# EasyEDA Pro project ProDoc_Board1_2025-08-02.epro

# Schematic Schematic1
Board Name: Board1; Create Date: 2025-07-23; Page Name: P1; Project Name: Silicon dev board; Schematic Name: Schematic1; Update Date: 2025-08-02; Company: EasyEDA.com; Page Size: A4; Version: V1.0
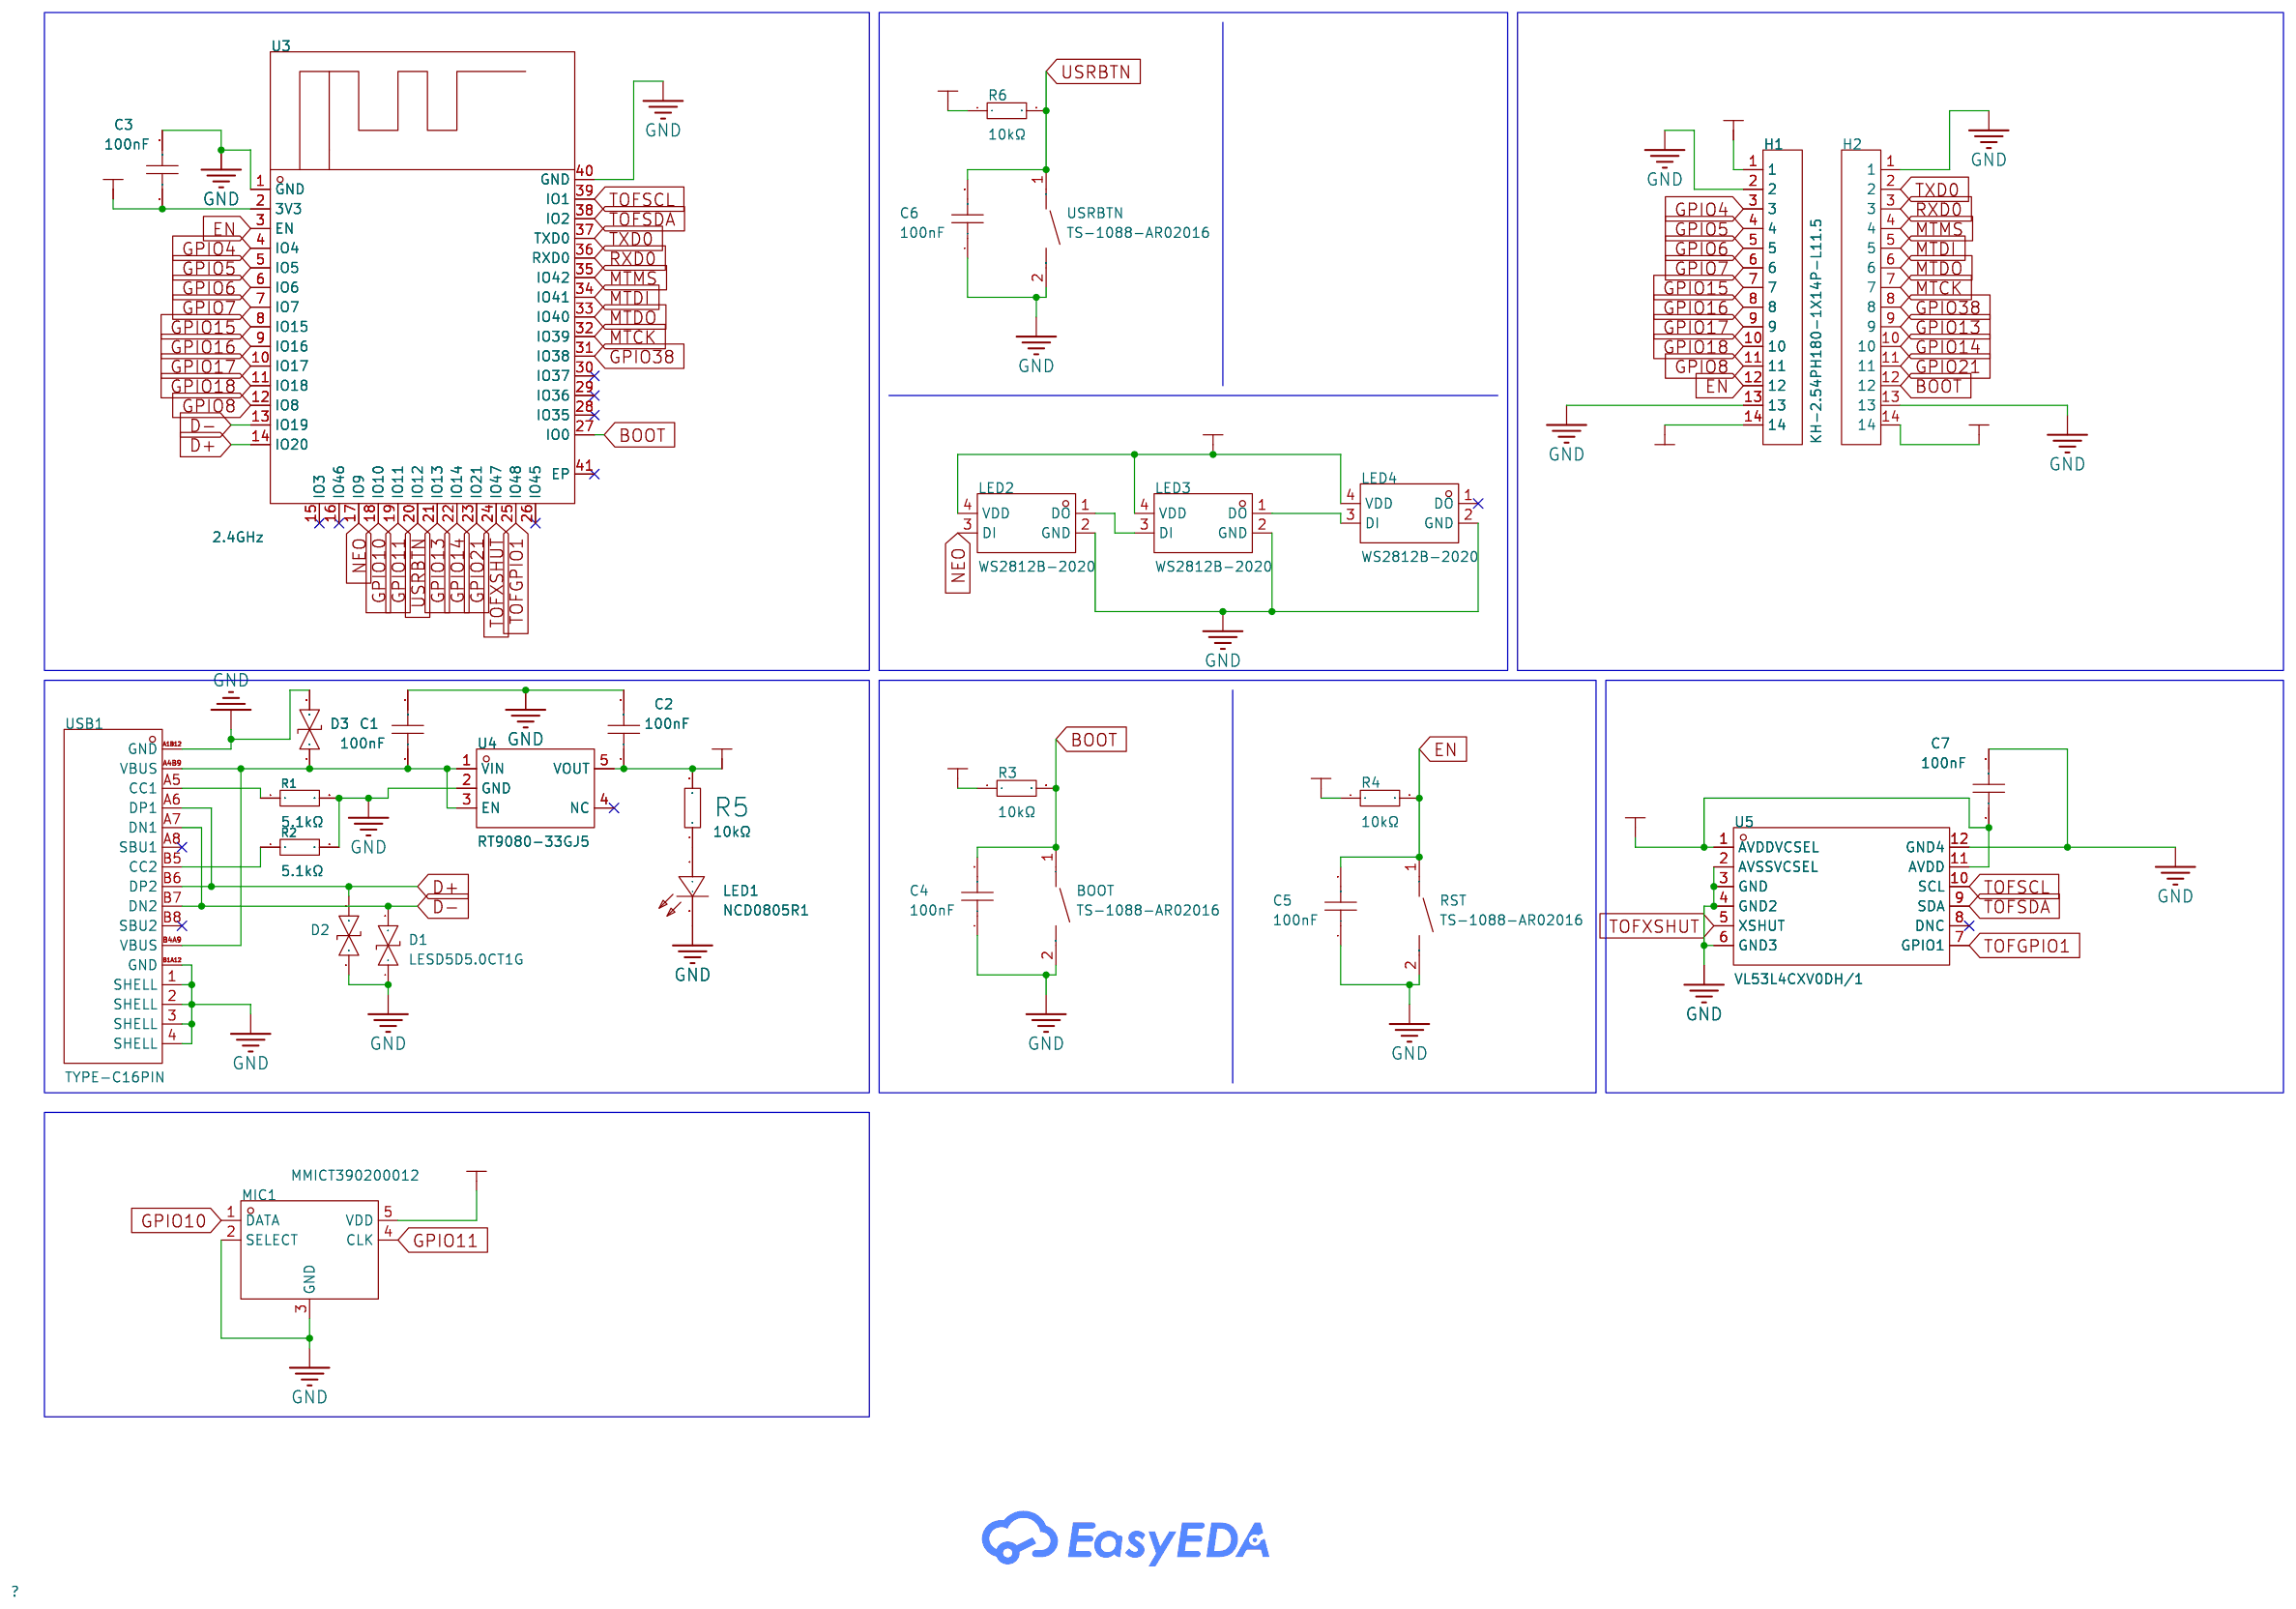
[diagram p0: schematic sheet]

## Parts
BOOT  TS-1088-AR02016  [SW-SMD_L3.9-W3.0-P4.45]
C1  100nF  [C0805]
C2  100nF  [C0805]
C3  100nF  [C0805]
C4  100nF  [C0805]
C5  100nF  [C0805]
C6  100nF  [C0805]
C7  100nF  [C0805]
D1  LESD5D5.0CT1G  [SOD-523_L1.2-W0.8-LS1.6-BI]
D2  LESD5D5.0CT1G  [SOD-523_L1.2-W0.8-LS1.6-BI]
D3  LESD5D5.0CT1G  [SOD-523_L1.2-W0.8-LS1.6-BI]
H1  KH-2.54PH180-1X14P-L11.5  [HDR-TH_14P-P2.54-V-M]
H2  KH-2.54PH180-1X14P-L11.5  [HDR-TH_14P-P2.54-V-M]
LED1  NCD0805R1  [LED0805-R-RD]
LED2  WS2812B-2020  [LED-SMD_4P-L2.0-W2.0-TL_WS2812B-2020]
LED3  WS2812B-2020  [LED-SMD_4P-L2.0-W2.0-TL_WS2812B-2020]
LED4  WS2812B-2020  [LED-SMD_4P-L2.0-W2.0-TL_WS2812B-2020]
MIC1  MMICT390200012  [MIC-SMD_5P-L3.5-W2.7-TL_MMICT390200012]
R1  5.1kΩ  [R0805]
R2  5.1kΩ  [R0805]
R3  10kΩ  [R0805]
R4  10kΩ  [R0805]
R5  10kΩ  [R0603]
R6  10kΩ  [R0805]
RST  TS-1088-AR02016  [SW-SMD_L3.9-W3.0-P4.45]
U3  2.4GHz  [WIFIM-SMD_ESP32-S3-WROOM-1-N8]
U4  RT9080-33GJ5  [TSOT-23-5_L2.9-W1.6-P0.95-LS2.8-BL]
U5  VL53L4CXV0DH/1  [OPTO-SMD_VL53L1CXV0FY-1]
USB1  TYPE-C16PIN  [USB-C-SMD_TYPE-C16PIN]
USRBTN  TS-1088-AR02016  [SW-SMD_L3.9-W3.0-P4.45]

## Library data of the parts
BOOT RST USRBTN = TS-1088-AR02016: Circuit:SPST Actuator Style:Round Button Operating Force:160gf Mounting Style:Brick nogging Switch Length:4mm Switch Width:3mm Switch Height:2mm Strike Gundam:不带 Contact Current:50mA Voltage Rating (DC):12V Insulation Resistance:100MΩ Actuator/Cap Color:B; LCSC Part Name: 4*3*2mm 立贴 轻触开关; Supplier Part: C720477; Manufacturer: XUNPU(讯普); Supplier Footprint: SMD; JLCPCB Part Class: Basic Part; Datasheet: https://atta.szlcsc.com/upload/public/pdf/source/20200810/C720475_60D09DD6C54279ADDB2DC25100F1CC11.pdf; Supplier: LCSC; Circuit: SPST; Actuator Style: Round Button; Operating Force: 160gf; Mounting Style: Brick nogging; Switch Length: 4mm; Switch Width: 3mm; Switch Height: 2mm; Strike Gundam: 不带; Contact Current: 50mA; Voltage Rating (DC): 12V; Insulation Resistance: 100MΩ; Actuator/Cap Color: Black; Pin Style: SMDSplicing; Mechanical Life: 10万次; Operating Temperature: -30℃~+80℃
C1-C7 = C0805B104K500NT: Capacitance:100nF Tolerance:±10% Tolerance:±10% Voltage Rating:50V Temperature Coefficient:X7R; LCSC Part Name: 100nF ±10% 50V; Supplier Part: C476766; Manufacturer: TORCH(火炬); Supplier Footprint: 0805; JLCPCB Part Class: Extended Part; Datasheet: https://atta.szlcsc.com/upload/public/pdf/source/20191230/C476766_171E30D5B7F7164A8210B8E948DFBAE0.pdf; Supplier: LCSC; Tolerance: ±10%; Voltage Rating: 50V; Temperature Coefficient: X7R
D1-D3 = LESD5D5.0CT1G: Polarity:Bidirectional Reverse Stand-Off Voltage (Vrwm):5V Clamping Voltage:18.6V Peak Pulse Current (Ipp):9.4A Voltage - Breakdown:5.6V Type:ESD; LCSC Part Name: 双向ESD; Supplier Part: C383211; Manufacturer: LRC(乐山无线电); Supplier Footprint: SOD-523; JLCPCB Part Class: Extended Part; Datasheet: https://atta.szlcsc.com/upload/public/pdf/source/20190807/C383211_633DF4B4E2C161403226E5235FE33A1C.pdf; Supplier: LCSC; Polarity: Bidirectional; Reverse Stand-Off Voltage (Vrwm): 5V; Clamping Voltage: 18.6V; Peak Pulse Current (Ipp): 9.4A; Voltage - Breakdown: 5.6V; Type: ESD
H1 H2 = KH-2.54PH180-1X14P-L11.5: Pin Structure:1x14P Pitch:2.54mm Row Spacing:- Circluar Pins/Square Pins:Policy Mounting Type:Straight Number of Rows:Single Row Number of Pins:14P Current Rating:3A Voltage Rating (Max):- Length of Mating Pin:6mm Insulation Height:2.5mm Length of End Con; LCSC Part Name: 1x14P 间距:2.54mm 方针 直插; Supplier Part: C2905490; Manufacturer: kinghelm(金航标); Supplier Footprint: 插件,P=2.54mm; JLCPCB Part Class: Extended Part; Datasheet: https://atta.szlcsc.com/upload/public/pdf/source/20211019/70B2F9BE166FB5933520F36B6C0BD4AD.pdf; Supplier: LCSC; Pin Structure: 1x14P; Pitch: 2.54mm; Circluar Pins/Square Pins: Policy; Mounting Type: Straight; Number of Rows: Single Row; Number of Pins: 14P; Current Rating: 3A; Length of Mating Pin: 6mm; Insulation Height: 2.5mm; Length of End Connection Pin: 3mm; Operating Temperature: -40℃~+105℃; Color: Black
LED1 = NCD0805R1_C84256: Lamp Holder Type:- Emitted Color:Red Forward Voltage (VF):1.6V~2.6V Forward Voltage (VF):1.6V~2.6V Power Dissipation:65mW Forward Current:20mA Dominant Wavelength:615nm~630nm Dominant Wavelength:615nm~630nm Peak Wavelength:- Diode Configuration:独立二极管 Lens; Supplier Part: C84256; Manufacturer: 国星光电; Supplier Footprint: 0805; JLCPCB Part Class: Basic Part; Datasheet: https://atta.szlcsc.com/upload/public/pdf/source/20200820/C84256_F0A75A43B3EAD75808600A0514C76B99.pdf; Supplier: LCSC; Emitted Color: Red; Forward Voltage (VF): 1.6V~2.6V; Power Dissipation: 65mW; Forward Current: 20mA; Dominant Wavelength: 615nm~630nm; Diode Configuration: 独立二极管; Lens Color: 无色透明透镜; Luminous Intensity: 67mcd~195mcd; Viewing Angle: 130°; Operating Temperature: -30℃~+85℃
LED2-LED4 = WS2812B-2020: Wavelength:515.6nm；622.5nm；470.4nm Luminous Intensity:- Fixed-Frequency Pwm Mode:- Data Transmission Rate:- Supply Voltage:- Supply Voltage:- Quiescent Dissipation:- Lens Color:-; LCSC Part Name: RGB三色; Supplier Part: C965555; Manufacturer: worldsemi; Supplier Footprint: SMD,2x2mm; JLCPCB Part Class: Extended Part; Datasheet: https://atta.szlcsc.com/upload/public/pdf/source/20241202/DEE3FC25B8AD87F3BB1718ACD77EDECD.pdf; Supplier: LCSC; Wavelength: 515.6nm；622.5nm；470.4nm
MIC1 = MMICT390200012: Direction:Omni-directional Voltage - Supply:1.65V~3.63V Voltage - Supply:1.65V~3.63V Current Consumption:650uA Current Consumption:650uA S/N Ratio:64dB Sensitivity:-32dB Sensitivity:-32dB Impedance:-; Supplier Part: C3171752; Manufacturer: TDK InvenSense(应美盛); JLCPCB Part Class: Extended Part; Datasheet: https://atta.szlcsc.com/upload/public/pdf/source/231023/C17526790-e655196fc8b61186ca7c7f8236c0f1c0.pdf; Supplier: LCSC; Direction: Omni-directional; Voltage - Supply: 1.65V~3.63V; Current Consumption: 650uA; S/N Ratio: 64dB; Sensitivity: -32dB
R1 R2 = RMC08055.1K1%N: Resistance:5.1kΩ Tolerance:±1% Tolerance:±1% Power(Watts):0.125W; LCSC Part Name: 5.1kΩ ±1% 125mW; Supplier Part: C269748; Manufacturer: Tyohm(幸亚电阻); Supplier Footprint: 0805; JLCPCB Part Class: Extended Part; Datasheet: https://atta.szlcsc.com/upload/public/pdf/source/20190115/C325956_D27151D492FFB3C9AB4A6F14FE01F30A.pdf; Supplier: LCSC; Tolerance: ±1%; Power(Watts): 0.125W
R3 R4 R6 = PTFR0805B10K0N9: Type:Thin Film Resistor Resistance:10kΩ Tolerance:±0.1% Tolerance:±0.1% Power(Watts):130mW Voltage-Supply(Max):150V Temperature Coefficient:±10ppm/℃ Temperature Coefficient:±10ppm/℃ Operating Temperature:-55℃~+125℃ Operating Temperature:-55℃~+125℃; LCSC Part Name: 薄膜电阻 10kΩ ±0.1% 130mW 车规级; Supplier Part: C328436; Manufacturer: RESI(开步睿思); Supplier Footprint: 0805; JLCPCB Part Class: Extended Part; Datasheet: https://atta.szlcsc.com/upload/public/pdf/source/20240506/11BDC7478D84177AC2A5326A65B6EB29.pdf; Supplier: LCSC; Type: Thin Film Resistor; Tolerance: ±0.1%; Power(Watts): 130mW; Voltage-Supply(Max): 150V; Temperature Coefficient: ±10ppm/℃; Operating Temperature: -55℃~+125℃
R5 = 0603WAF1002T5E: Type:Thick Film Resistor Resistance:10kΩ Tolerance:±1% Tolerance:±1% Power(Watts):100mW Voltage-Supply(Max):75V Temperature Coefficient:±100ppm/℃ Temperature Coefficient:±100ppm/℃ Operating Temperature:-55℃~+155℃ Operating Temperature:-55℃~+155℃; LCSC Part Name: 厚膜电阻 10kΩ ±1% 100mW; Supplier Part: C25804; Manufacturer: UNI-ROYAL(厚声); Supplier Footprint: 0603; JLCPCB Part Class: Basic Part; Datasheet: https://atta.szlcsc.com/upload/public/pdf/source/20200306/C422600_1E6D84923E4A46A82E41ADD87F860B5C.pdf; Supplier: LCSC; Type: Thick Film Resistor; Tolerance: ±1%; Power(Watts): 100mW; Voltage-Supply(Max): 75V; Temperature Coefficient: ±100ppm/℃; Operating Temperature: -55℃~+155℃
U3 = ESP32-S3-WROOM-1-N8: Core Processor:ESP32-S3 Chip Support Interface:I2C；GPIO；SPI；PWM；ADC；UART；USB；I2S Frequency:2.4GHz; LCSC Part Name: 通用型Wi-Fi+低功耗蓝牙MCU模组; Supplier Part: C2913198; Manufacturer: ESPRESSIF(乐鑫); Supplier Footprint: SMD,18x25.5mm; JLCPCB Part Class: Extended Part; Datasheet: https://atta.szlcsc.com/upload/public/pdf/source/20221026/9A44C6421221D672346AAE72DF9F8146.pdf; Supplier: LCSC; Core Processor: ESP32-S3 Chip; Support Interface: I2C；GPIO；SPI；PWM；ADC；UART；USB；I2S
U4 = RT9080-33GJ5: Output Type:Fixed Maximum Input Voltage:5.5V Output Voltage:3.3V Output Voltage:3.3V Output Current:600mA Power Supply Rejection Ratio (PSRR):75dB@(1kHz) Dropout Voltage:530mV@(600mA) standby current:4uA Feature:ESD Protection；Thermal Protection(TSD)；Over; Supplier Part: C841192; Manufacturer: RICHTEK(立锜); Supplier Footprint: TSOT-23-5; JLCPCB Part Class: Extended Part; Datasheet: https://atta.szlcsc.com/upload/public/pdf/source/20200918/C841192_D291BBB33AFC8816B317CCB22A728955.pdf; Supplier: LCSC; Output Type: Fixed; Maximum Input Voltage: 5.5V; Output Voltage: 3.3V; Output Current: 600mA; Power Supply Rejection Ratio (PSRR): 75dB@(1kHz); Dropout Voltage: 530mV@(600mA); standby current: 4uA; Feature: ESD Protection；Thermal Protection(TSD)；Overcurrent Protection(OCP)；With ability; Operating Temperature: -40℃~+85℃@(Ta); Output Polarity: Positive electrode; Number of Outputs: 1
U5 = VL53L4CXV0DH/1: Voltage - Supply:2.6V~3.5V Voltage - Supply:2.6V~3.5V Linear Range:0m~6m Linear Range:0m~6m Current - Supply:21mA; LCSC Part Name: I2C接口的具有扩展范围测量的飞行时间传感器; Supplier Part: C3178292; Manufacturer: ST(意法半导体); Supplier Footprint: SMD-12P,2.4x4.4mm; JLCPCB Part Class: Extended Part; Datasheet: https://atta.szlcsc.com/upload/public/pdf/source/20221107/6F567E0F7F9EC6D2C71C63496C772559.pdf; Supplier: LCSC; Voltage - Supply: 2.6V~3.5V; Linear Range: 0m~6m; Current - Supply: 21mA
USB1 = TYPE-C16PIN: Connector Type:Type-C Protocol Standard:USB 3.1 Gender:Female Mounting Type:Surface Mount, Right Angle Number of Contacts:16P Number of Ports:1 Current Rating-Power:3A Voltage Rating:30V Connect-Disconnect Life:10,000 Cycles Detection color:Black Operatin; LCSC Part Name: Type-C 母 卧贴; Supplier Part: C393939; Manufacturer: SHOU HAN(首韩); Supplier Footprint: SMD; JLCPCB Part Class: Extended Part; Datasheet: https://atta.szlcsc.com/upload/public/pdf/source/20250618/9FBF2A26CFCE0E69298FA0B726710E9E.pdf; Supplier: LCSC; Connector Type: Type-C; Protocol Standard: USB 3.1; Gender: Female; Mounting Type: Surface Mount, Right Angle; Number of Contacts: 16P; Number of Ports: 1; Current Rating-Power: 3A; Voltage Rating: 30V; Connect-Disconnect Life: 10,000 Cycles; Detection color: Black; Operating Temperature: -40℃~+85℃

## Nets
+3.3V: C2.1 C3.1 C7.1 H1.1 H1.14 H2.14 LED2.4(VDD) LED3.4(VDD) LED4.4(VDD) MIC1.5(VDD) R3.1 R4.1 R5.2 R6.1 U3.2(3V3) U4.5(VOUT) U5.1(AVDDVCSEL) U5.11(AVDD)
GND: BOOT.2 C1.2 C2.2 C3.2 C4.1 C5.1 C6.1 C7.2 D1.1 D2.1 D3.2 H1.2 H1.13 H2.1 H2.13 LED1.2(-) LED2.2(GND) LED3.2(GND) LED4.2(GND) MIC1.2(SELECT) MIC1.3(GND) R1.2 R2.2 RST.2 U3.1(GND) U3.40(GND) U4.2(GND) U5.2(AVSSVCSEL) U5.3(GND) U5.4(GND2) U5.6(GND3) U5.12(GND4) USB1.1(SHELL) USB1.2(SHELL) USB1.3(SHELL) USB1.4(SHELL) USB1.A1B12(GND) USB1.B1A12(GND) USRBTN.2
BOOT: BOOT.1 C4.2 H2.12 R3.2 U3.27(IO0)
D+: D2.2 U3.14(IO20) USB1.A6(DP1) USB1.B6(DP2)
D-: D1.2 U3.13(IO19) USB1.A7(DN1) USB1.B7(DN2)
EN: C5.2 H1.12 R4.2 RST.1 U3.3(EN)
GPIO4: H1.3 U3.4(IO4)
GPIO5: H1.4 U3.5(IO5)
GPIO6: H1.5 U3.6(IO6)
GPIO7: H1.6 U3.7(IO7)
GPIO8: H1.11 U3.12(IO8)
GPIO10: MIC1.1(DATA) U3.18(IO10)
GPIO11: MIC1.4(CLK) U3.19(IO11)
GPIO13: H2.9 U3.21(IO13)
GPIO14: H2.10 U3.22(IO14)
GPIO15: H1.7 U3.8(IO15)
GPIO16: H1.8 U3.9(IO16)
GPIO17: H1.9 U3.10(IO17)
GPIO18: H1.10 U3.11(IO18)
GPIO21: H2.11 U3.23(IO21)
GPIO38: H2.8 U3.31(IO38)
MTCK: H2.7 U3.32(IO39)
MTDI: H2.5 U3.34(IO41)
MTDO: H2.6 U3.33(IO40)
MTMS: H2.4 U3.35(IO42)
NEO: LED2.3(DI) U3.17(IO9)
RXD0: H2.3 U3.36(RXD0)
TOFGPIO1: U3.25(IO48) U5.7(GPIO1)
TOFSCL: U3.39(IO1) U5.10(SCL)
TOFSDA: U3.38(IO2) U5.9(SDA)
TOFXSHUT: U3.24(IO47) U5.5(XSHUT)
TXD0: H2.2 U3.37(TXD0)
USRBTN: C6.2 R6.2 U3.20(IO12) USRBTN.1
$1N1348: C1.1 D3.1 U4.1(VIN) U4.3(EN) USB1.A4B9(VBUS) USB1.B4A9(VBUS)
$1N1566: R1.1 USB1.A5(CC1)
$1N1581: R2.1 USB1.B5(CC2)
$1N3564: LED1.1(+) R5.1
$1N9702: LED2.1(DO) LED3.3(DI)
$1N9708: LED3.1(DO) LED4.3(DI)

Not connected (* = marked no-connect by the designer): LED4 1(DO)*; U3 15(IO3)* 16(IO46)* 26(IO45)* 28(IO35)* 29(IO36)* 30(IO37)* 41(EP)*; U4 4(NC)*; U5 8(DNC)*; USB1 A8(SBU1)* B8(SBU2)*

# Board PCB1
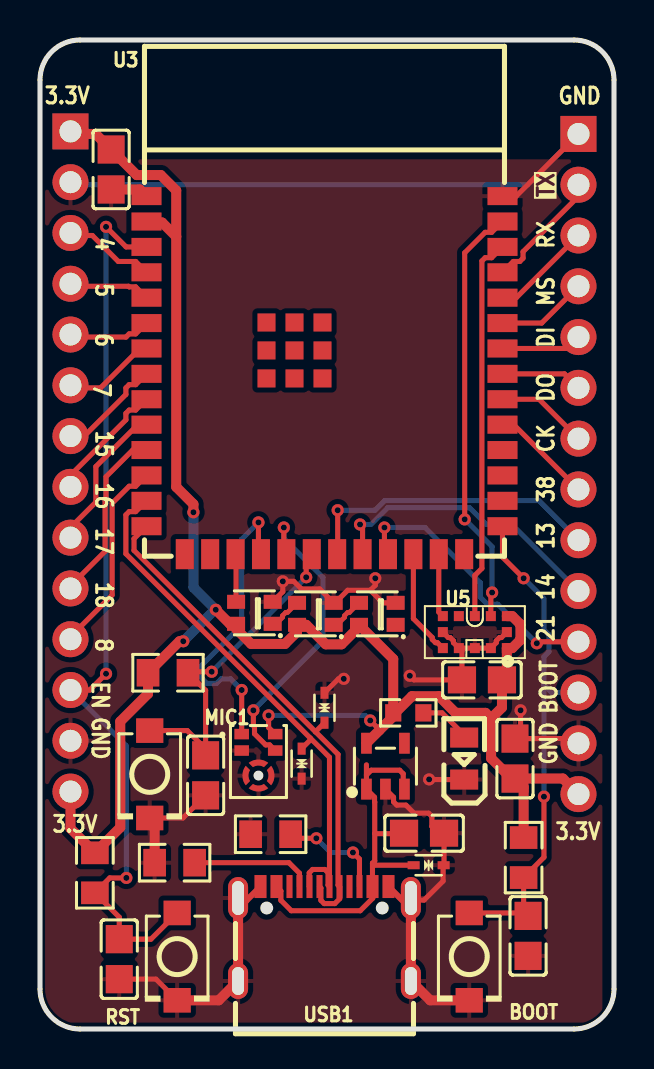
[diagram p1: board, top side]
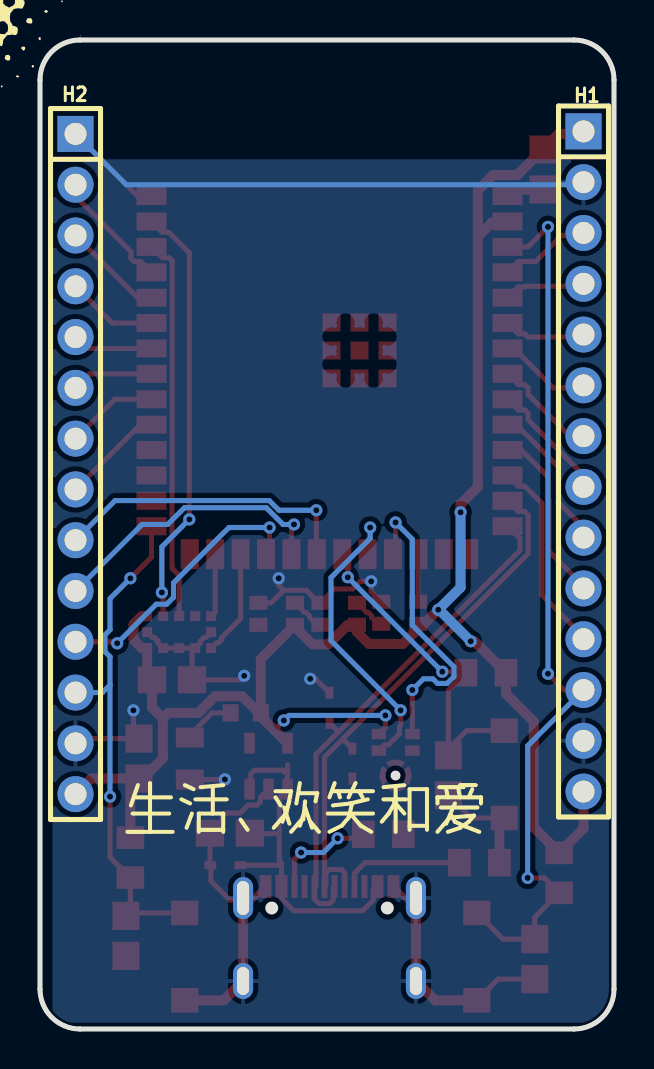
[diagram p2: board, bottom side, seen from below]

Outline 28.7 x 49.47 mm; copper layers: Top Layer, Bottom Layer. Coordinates in mm from the lower left corner of the outline.
Outline path: 0,47.47 0,2 arc(0.59,0.59) 2,0 26.7,0 arc(28.11,0.59) 28.7,2 28.7,47.47 arc(28.11,48.88) 26.7,49.47 2,49.47 arc(0.59,48.88) 0,47.47
Stack: Top Layer 0.035mm / Dielectric1 1.51mm FR4 er 4.5 / Bottom Layer 0.035mm

## Design rules (mm)
net D-: DP1
net D+: DP1
template: JLCPCB Capability(Two Layers Board)
spacing copperThickness1oz (default): track to track 0.102, other pairs 0.152 to 0.3
spacing copperThickness2oz: track to track 0.203, other pairs 0.152 to 0.3
track width copperThickness1oz (default): min 0.127, default 0.254, max 2.54
track width copperThickness2oz: min 0.203, default 0.254, max 2.54
differential pair differentialPair (default): width min 0.127, default 0.254, max 2.54; gap min 0.152, default 0.152
via viaSize (default): diameter min 0.5, default 0.61, max 10; hole min 0.3, default 0.305, max 6.3

## Placement (name value [footprint] x y rotation side)
BOOT  TS-1088-AR02016  [SW-SMD_L3.9-W3.0-P4.45]  21.46 3.62 270 top
C1  100nF  [C0805]  19.2 9.79 0 top
C2  100nF  [C0805]  23.75 13.53 90 top
C3  100nF  [C0805]  3.56 42.99 270 top
C4  100nF  [C0805]  24.4 4.66 90 top
C5  100nF  [C0805]  3.96 3.49 90 top
C6  100nF  [C0805]  8.28 12.69 90 top
C7  100nF  [C0805]  22.1 17.46 180 top
D1  LESD5D5.0CT1G  [SOD-523_L1.2-W0.8-LS1.6-BI]  13.08 13.27 90 top
D2  LESD5D5.0CT1G  [SOD-523_L1.2-W0.8-LS1.6-BI]  14.22 16.07 270 top
D3  LESD5D5.0CT1G  [SOD-523_L1.2-W0.8-LS1.6-BI]  19.43 8.19 0 top
H1  KH-2.54PH180-1X14P-L11.5  [HDR-TH_14P-P2.54-V-M]  1.52 28.39 270 bottom
H2  KH-2.54PH180-1X14P-L11.5  [HDR-TH_14P-P2.54-V-M]  26.92 28.26 270 bottom
LED1  NCD0805R1  [LED0805-R-RD]  21.21 13.53 90 top
LED2  WS2812B-2020  [LED-SMD_4P-L2.0-W2.0-TL_WS2812B-2020]  10.72 20.82 180 top
LED3  WS2812B-2020  [LED-SMD_4P-L2.0-W2.0-TL_WS2812B-2020]  13.77 20.77 180 top
LED4  WS2812B-2020  [LED-SMD_4P-L2.0-W2.0-TL_WS2812B-2020]  16.87 20.77 180 top
MIC1  MMICT390200012  [MIC-SMD_5P-L3.5-W2.7-TL_MMICT390200012]  10.92 13.4 0 top
R1  5.1kΩ  [R0805]  6.73 8.32 180 top
R2  5.1kΩ  [R0805]  11.53 9.74 180 top
R3  10kΩ  [R0805]  24.18 8.57 270 top
R4  10kΩ  [R0805]  2.74 7.81 270 top
R5  10kΩ  [R0603]  18.42 15.81 180 top
R6  10kΩ  [R0805]  6.4 17.82 0 top
RST  TS-1088-AR02016  [SW-SMD_L3.9-W3.0-P4.45]  6.86 3.62 270 top
U3  2.4GHz  [WIFIM-SMD_ESP32-S3-WROOM-1-N8]  14.22 32.7 0 top
U4  RT9080-33GJ5  [TSOT-23-5_L2.9-W1.6-P0.95-LS2.8-BL]  17.27 13.15 0 top
U5  VL53L4CXV0DH/1  [OPTO-SMD_VL53L1CXV0FY-1]  21.74 19.85 0 top
USB1  TYPE-C16PIN  [USB-C-SMD_TYPE-C16PIN]  14.22 4.76 0 top
USRBTN  TS-1088-AR02016  [SW-SMD_L3.9-W3.0-P4.45]  5.49 12.74 270 top

## Footprints (pads in the part's own frame, mm; a bottom-side part is the same pattern mirrored in y, then rotated)
C0805
  rect 1.41x1.35 smd: 1(-1,0) 2(1,0)
HDR-TH_14P-P2.54-V-M
  rect 1.8x1.8 hole 1.1: 1(-16.51,0)
  round 1.8 hole 1.1: 2(-13.97,0) 3(-11.43,0) 4(-8.89,0) 5(-6.35,0) 6(-3.81,0) 7(-1.27,0) 8(1.27,0) 9(3.81,0) 10(6.35,0) 11(8.89,0) 12(11.43,0) 13(13.97,0) 14(16.51,0)
LED0805-R-RD
  rect 1x1.399 smd: 1(1.05,0) 2(-1.05,0)
LED-SMD_4P-L2.0-W2.0-TL_WS2812B-2020
  rect 0.9x0.7 smd: 1(-0.915,0.55) 2(-0.915,-0.55) 3(0.915,-0.55) 4(0.915,0.55)
MIC-SMD_5P-L3.5-W2.7-TL_MMICT390200012
  rect 0.725x0.522 smd: 1(-0.838,1.351) 2(-0.838,0.529) 4(0.838,0.529) 5(0.838,1.351)
  custom 0.38x0.974 smd: 3(-0.629,-0.728) 3(0.629,-0.717)
  custom 0.974x0.381 smd: 3(-0.005,-0.093) 3(0.005,-1.351)
OPTO-SMD_VL53L1CXV0FY-1
  rect 0.5x0.5 smd: 1(1.6,-0.8) 2(0.8,-0.8) 3(0,-0.8) 4(-0.8,-0.8) 5(-1.6,-0.8) 6(-1.6,0) 7(-1.6,0.8) 8(-0.8,0.8) 9(0,0.8) 10(0.8,0.8) 11(1.6,0.8) 12(1.6,0)
R0603
  rect 0.806x0.864 smd: 1(-0.753,0) 2(0.753,0)
R0805
  rect 1.133x1.377 smd: 1(-1,0) 2(1,0)
SOD-523_L1.2-W0.8-LS1.6-BI
  rect 0.6x0.4 smd: 1(-0.75,0) 2(0.75,0)
SW-SMD_L3.9-W3.0-P4.45
  rect 1.23x1.36 smd: 1(-2.185,0) 2(2.185,0)
TSOT-23-5_L2.9-W1.6-P0.95-LS2.8-BL
  rect 0.532x1.045 smd: 1(-0.95,-1.147) 2(0,-1.147) 3(0.95,-1.147) 4(0.95,1.147) 5(-0.95,1.147)
USB-C-SMD_TYPE-C16PIN
  oval 1x2.1 hole 0.6x1.7: 1(-4.32,1.788) 2(4.32,1.788)
  oval 1x1.8 hole 0.6x1.4: 3(-4.32,-2.362) 4(4.32,-2.362)
  rect 0.6x1.15 smd: A1B12(-3.2,2.362) A4B9(-2.4,2.362) B1A12(3.2,2.362) B4A9(2.4,2.362)
  rect 0.3x1.15 smd: A5(-1.25,2.362) A6(-0.25,2.362) A7(0.25,2.362) A8(1.25,2.362) B5(1.75,2.362) B6(0.75,2.362) B7(-0.75,2.362) B8(-1.75,2.362)
WIFIM-SMD_ESP32-S3-WROOM-1-N8
  rect 1.5x0.9 smd: 1(-8.9,8.954) 2(-8.9,7.684) 3(-8.9,6.415) 4(-8.9,5.144) 5(-8.9,3.874) 6(-8.9,2.604) 7(-8.9,1.335) 8(-8.9,0.065) 9(-8.9,-1.206) 10(-8.9,-2.475) 11(-8.9,-3.745) 12(-8.9,-5.016) 13(-8.9,-6.285) 14(-8.9,-7.556) 27(8.9,-7.556) 28(8.9,-6.285) 29(8.9,-5.016) 30(8.9,-3.745) 31(8.9,-2.475) 32(8.9,-1.206) 33(8.9,0.065) 34(8.9,1.335) 35(8.9,2.604) 36(8.9,3.874) 37(8.9,5.144) 38(8.9,6.415) 39(8.9,7.684) 40(8.9,8.954)
  rect 0.9x1.5 smd: 15(-6.985,-8.954) 16(-5.715,-8.954) 17(-4.445,-8.954) 18(-3.175,-8.954) 19(-1.905,-8.954) 20(-0.635,-8.954) 21(0.635,-8.954) 22(1.905,-8.954) 23(3.175,-8.954) 24(4.445,-8.954) 25(5.715,-8.954) 26(6.985,-8.954)
  rect 0.9x0.9 smd: 41(-2.9,2.635) 41(-2.9,1.235) 41(-2.9,-0.165) 41(-1.5,2.635) 41(-1.5,1.235) 41(-1.5,-0.165) 41(-0.1,2.635) 41(-0.1,1.235) 41(-0.1,-0.165)

## Nets
As in the schematic.

Pads without a net: LED4 1; U3 15 16 26 28 29 30 41; U4 4; U5 8; USB1 A8 B8

## Via types
v1: diameter 0.61, hole 0.305, Top Layer to Bottom Layer, 30 vias

## Routing (per net, layer and track width the routed paths; a pad name or vN(x,y) marks a point on that pad's centre or on a via; arc(x,y) is an arc through that point)
+3.3V: length 94.6
  Top Layer w0.254: v1(16.51,15.43) 16.96,14.98 16.96,14.93 ; v1(11.43,15.69) 11.43,15.08 MIC1.5
  Top Layer w0.5: 6.81,39.63 6.81,41.94 6.04,42.71 4.84,42.71 C3.1 2.78,44.77 1.27,44.77 ; 6.81,39.63 6.11,40.34 5.38,40.34 U3.2 ; 6.81,39.63 6.81,27.11 7.67,26.25 v1(7.67,25.85) ; R5.2 17.66,18.5 LED4.4 15.95,20.12 15.08,19.24 14.29,19.24 13.31,20.22 LED3.4 12.85,19.86 12.25,19.26 10.56,19.26 9.8,20.01 LED2.4 9.49,20.27 v1(8.79,20.97) ; R5.2 17.76,15.81 18.6,16.65 19.94,16.65 20.78,15.81 22.28,15.81 22.56,15.53 ; R5.2 17.66,15.63 U4.5 ; C2.1 24.18,12.09 R3.1 ; C2.1 26.15,12.53 H2.14 ; C2.1 23.75,12.63 23.75,12.64 23.46,12.64 22.56,13.54 22.56,15.53 ; 22.56,15.53 23.1,16.08 C7.1 23.34,17.71 U5.1 23.61,19.05 23.99,19.43 23.99,19.46 24.02,19.49 24.02,20.22 23.99,20.25 23.99,20.27 23.61,20.65 U5.11 ; v1(7.16,19.39) 6.98,19.39 R6.1 5.4,16.77 4.01,15.38 4.01,10.08 R4.1 1.52,10.03 H1.14
  Bottom Layer w0.254: v1(16.51,15.43) 16.26,15.69 v1(11.43,15.69)
  Bottom Layer w0.5: v1(7.67,25.85) 7.67,22.09 v1(8.79,20.97) 8.74,20.97 v1(7.16,19.39)
GND: length 93.7
  Top Layer w0.254: v1(19.46,12.49) 19.47,12.48 LED1.2 ; C5.1 5.8,2.49 RST.2 ; H2.1 23.81,41.66 U3.40 ; U5.12 23.07,19.58 22.98,19.58 22.81,19.42 22.81,19.32 U5.2 U5.3 U5.4 ; v1(15.19,17.51) 14.92,17.51 D2.1 ; H2.13 26.69,14.53 C2.2 24.03,14.81 v1(24.03,15.94) ; 16.52,21.94 15.39,21.94 14.76,21.32 LED3.2 13.99,22.01 13.07,22.01 12.69,22.39 v1(12.14,22.39) 12.14,21.87 LED2.2 ; 16.52,21.94 16.76,22.19 v1(16.76,22.54) ; 16.52,21.94 17.15,21.32 LED4.2 ; 9.9,6.41 9.65,6.41 ; U5.6 20.41,19.58 20.51,19.58 20.67,19.42 20.67,19.32 U5.4 ; U5.4 21.1,18.9 C7.2 18.69,17.46 v1(18.49,17.67) ; U4.2 17.68,11.59 17.68,11.36 17.84,11.2 18.3,11.2 18.7,10.8 19.43,10.8 19.59,10.63 19.59,10.13 19.88,9.84 20.15,9.84 C1.2 20.2,8.21 D3.2 20.16,8.17 20.16,7.4 19.2,6.45 18.65,6.45 USB1.2 ; C6.1 7.15,10.55 USRBTN.2
  Top Layer w0.3: 9.9,6.41 10.31,6.41 USB1.A1B12 ; 18.54,6.05 18.5,6.05 USB1.B1A12
  Top Layer w0.5: 18.54,6.05 USB1.4 19.51,1.44 BOOT.2 ; C3.2 4.99,41.99 U3.1 ; USRBTN.2 5.73,10.31 R1.2 ; RST.2 8.94,1.44 USB1.3 9.9,6.41
  Bottom Layer w0.254: 1.27,42.23 24.38,42.23 H2.1
BOOT: length 25.8
  Top Layer w0.254: v1(25.2,11.62) 25.2,8.59 R3.2 24.18,5.88 24.26,5.81 ; U3.27 23.12,23.6 v1(24.18,22.54) ; 24.26,5.81 BOOT.1 ; 24.26,5.81 C4.2
  Bottom Layer w0.254: v1(24.18,22.54) 25.2,21.53 25.2,19.97 25.45,19.71 25.45,18.87 25.2,18.62 25.2,17.21 ; 25.2,17.21 v1(25.2,11.62) ; 25.2,17.21 25.58,16.83 H2.12
D+: length 25.6
  Top Layer w0.254: USB1.A6 14.05,7.06 14.05,6.44 14.21,6.27 14.74,6.27 14.99,6.52 14.99,7.11 USB1.B6 14.9,7.2 14.9,13.74 13.78,14.86 ; 13.78,14.86 13.78,14.88 D2.2 ; 13.78,14.86 4.7,23.94 4.7,24.53 U3.14
D-: length 27.3
  Top Layer w0.254: D1.2 13.51,14.45 13.51,14.55 ; U3.13 4.78,25.88 4.46,25.88 4.3,25.71 4.3,23.77 13.51,14.55 ; USB1.B7 13.46,7.14 13.46,7.81 13.63,7.98 14.24,7.98 14.4,7.82 14.4,7.2 USB1.A7 14.47,13.59 13.51,14.55
EN: length 45.6
  Top Layer w0.254: RST.1 5.55,4.49 C5.2 3.96,5.59 R4.2 3.49,7.56 v1(4.32,7.56) ; H1.12 2.49,16.96 v1(3.3,17.77) ; v1(3.3,40.12) 4.3,39.12 U3.3
  Bottom Layer w0.254: v1(4.32,7.56) 4.32,14.16 H1.12 ; v1(3.3,40.12) v1(3.3,17.77)
GPIO4: length 4.8
  Top Layer w0.254: U3.4 4.78,38.39 3.92,38.39 2.62,39.69 1.27,39.69
GPIO5: length 4.3
  Top Layer w0.254: 1.27,37.15 4.43,37.15 4.46,37.12 4.78,37.12 U3.5
GPIO6: length 4.3
  Top Layer w0.254: 1.27,34.61 4.3,34.61 4.46,34.77 4.78,34.77 U3.6
GPIO7: length 4.9
  Top Layer w0.254: 1.27,32.07 3.03,32.07 5,34.04 U3.7
GPIO8: length 10.2
  Top Layer w0.254: 1.27,19.37 3.61,21.71 3.61,26.3 4.46,27.15 4.78,27.15 U3.12
GPIO10: length 15.3
  Top Layer w0.254: U3.18 10.92,23.88 v1(10.92,25.34) ; MIC1.1 v1(10.08,16.96)
  Bottom Layer w0.254: v1(10.92,25.34) 10.08,24.5 10.08,20.19 8,18.11 8,17.63 8.34,17.29 8.83,17.29 9.06,17.51 9.53,17.51 v1(10.08,16.96)
GPIO11: length 15.4
  Top Layer w0.254: v1(10.67,15.94) 10.67,15.19 10.73,15.13 10.73,14.77 11.28,14.21 11.48,14.21 MIC1.4 ; U3.19 12.19,23.88 v1(12.19,25.08)
  Bottom Layer w0.254: v1(12.19,25.08) 12.19,24.54 14.15,22.58 14.15,19.42 v1(10.67,15.94)
GPIO13: length 15.3
  Top Layer w0.254: v1(14.88,25.95) 14.88,23.77 U3.21
  Bottom Layer w0.254: H2.9 24.94,26.43 17.24,26.43 16.76,25.95 v1(14.88,25.95)
GPIO14: length 14.5
  Top Layer w0.254: U3.22 16.13,25.11 v1(16,25.24)
  Bottom Layer w0.254: v1(16,25.24) 16.55,25.24 17.39,26.07 21.48,26.07 22.31,25.24 23.6,25.24 H2.10
GPIO15: length 5.6
  Top Layer w0.254: 1.27,29.53 2.08,29.53 4.3,31.74 4.3,32.06 4.46,32.23 4.78,32.23 U3.8
GPIO16: length 6.4
  Top Layer w0.254: 1.27,26.99 1.27,27.44 4.3,30.47 4.3,30.79 4.46,30.96 4.78,30.96 U3.9
GPIO17: length 7.7
  Top Layer w0.254: U3.10 4.89,30.23 2.79,28.13 2.79,26.35 1.27,24.83 1.27,24.45
GPIO18: length 9.1
  Top Layer w0.254: U3.11 4.64,28.96 3.3,27.62 3.3,26.49 3.25,26.44 3.25,23.89 1.27,21.91
GPIO21: length 14
  Top Layer w0.254: H2.11 24.92,19.37 v1(24.84,19.29) ; v1(17.22,25.08) 17.22,23.93 17.4,23.75
  Bottom Layer w0.254: v1(24.84,19.29) 22.89,21.25 22.36,21.25 22.02,21.59 22.02,22.31 19.25,25.08 v1(17.22,25.08)
GPIO38: length 5.1
  Top Layer w0.254: U3.31 23.68,30.23 H2.8
MTCK: length 4.6
  Top Layer w0.254: H2.7 24.95,31.5 U3.32
MTDI: length 4
  Top Layer w0.254: H2.5 26.35,34.04 U3.34
MTDO: length 4.1
  Top Layer w0.254: U3.33 26.22,32.77 H2.6
MTMS: length 4.6
  Top Layer w0.254: U3.35 25.08,35.31 H2.4
NEO: length 2.4
  Top Layer w0.254: 9.78,23.75 9.8,23.72 LED2.3
RXD0: length 5.1
  Top Layer w0.254: U3.36 23.81,36.58 H2.3
TOFGPIO1: length 3.2
  Top Layer w0.254: U5.7 19.94,20.85 U3.25
TOFSCL: length 21.3
  Top Layer w0.254: U5.10 22.54,21.77 v1(22.61,21.83) ; U3.39 22.58,39.85 22.26,39.85 21.23,38.82 v1(21.23,25.49)
  Bottom Layer w0.254: v1(22.61,21.83) 22.61,24.12 v1(21.23,25.49)
TOFSDA: length 19.2
  Top Layer w0.254: U3.38 22.58,38.58 22.26,38.58 22.09,38.41 22.09,23.04 21.74,22.69 U5.9
TOFXSHUT: length 5.4
  Top Layer w0.254: U3.24 18.67,20.52 19.61,19.58 19.61,19.49 19.78,19.32 19.87,19.32 U5.5
TXD0: length 6.1
  Top Layer w0.254: U3.37 23.67,38.39 23.99,38.39 24.15,38.55 24.15,38.88 26.92,41.65 H2.2
USRBTN: length 16.8
  Top Layer w0.254: v1(8.59,17.87) 7.45,17.87 R6.2 8.28,16.94 8.28,14.01 ; 8.28,14.01 C6.2 ; 8.28,14.01 7.37,14.92 USRBTN.1 ; v1(13.31,22.59) 13.31,23.47 U3.20
  Bottom Layer w0.254: v1(13.31,22.59) v1(8.59,17.87)
$1N1348: length 18.6
  Top Layer w0.254: 16.62,8.29 16.72,8.19 D3.1 ; 16.62,8.29 16.74,8.4 16.74,9.77 ; 16.62,8.29 USB1.B4A9 16.64,7.11 16.64,6.54 16.01,5.92 12.56,5.92 12.05,6.44 12.05,6.91 USB1.A4B9 ; 16.32,12.7 16.32,12.51 ; 16.32,12.7 16.56,12.94 17.98,12.94 18.16,12.76 18.16,12.06 U4.3 ; 16.32,12.7 16.32,13.21 ; U4.1 16.73,11.59 16.73,11.36 16.74,11.35 16.74,9.77 ; C1.1 18.18,9.77 16.74,9.77
$1N1566: length 6.1
  Top Layer w0.254: USB1.A5 12.97,7.79 12.45,8.32 R1.1
$1N1581: length 5.3
  Top Layer w0.254: v1(15.65,8.83) 15.97,8.5 USB1.B5 ; v1(13.82,9.54) 12.74,9.54 R2.1
  Bottom Layer w0.254: v1(13.82,9.54) 14.53,8.83 v1(15.65,8.83)
$1N3564: length 2.5
  Top Layer w0.254: 21.21,14.7 20.1,15.81 R5.1
$1N9702: length 1.7
  Top Layer w0.24: LED2.1 11.8,20.27 12.13,20.59 12.13,20.68 12.29,20.84 12.37,20.84 LED3.3
$1N9708: length 1.8
  Top Layer w0.24: LED3.1 14.85,20.22 15.23,20.59 15.23,20.68 15.39,20.84 15.47,20.84 LED4.3

## Copper pours and planes (outline as drawn; the poured copper is in the pictures)
GND on Top Layer: 0.18,43.5 28.12,43.5 28.12,0.32 0.18,0.32
GND on Bottom Layer: 0.13,43.5 28.07,43.5 28.07,0.32 0.13,0.32

## Text on the board
Bottom Silkscreen Layer: 生活、欢笑和爱
Top Silkscreen Layer: EN | GND | 7 | 6 | 8 | 4 | 5 | 15 | 16 | 17 | 18 | 3.3V | TX | RX | MS | DI | DO | CK | 38 | 13 | 14 | 21 | BOOT
